# EAGLE design Sport Analyzer Chronojump (EAGLE 9.6.2)
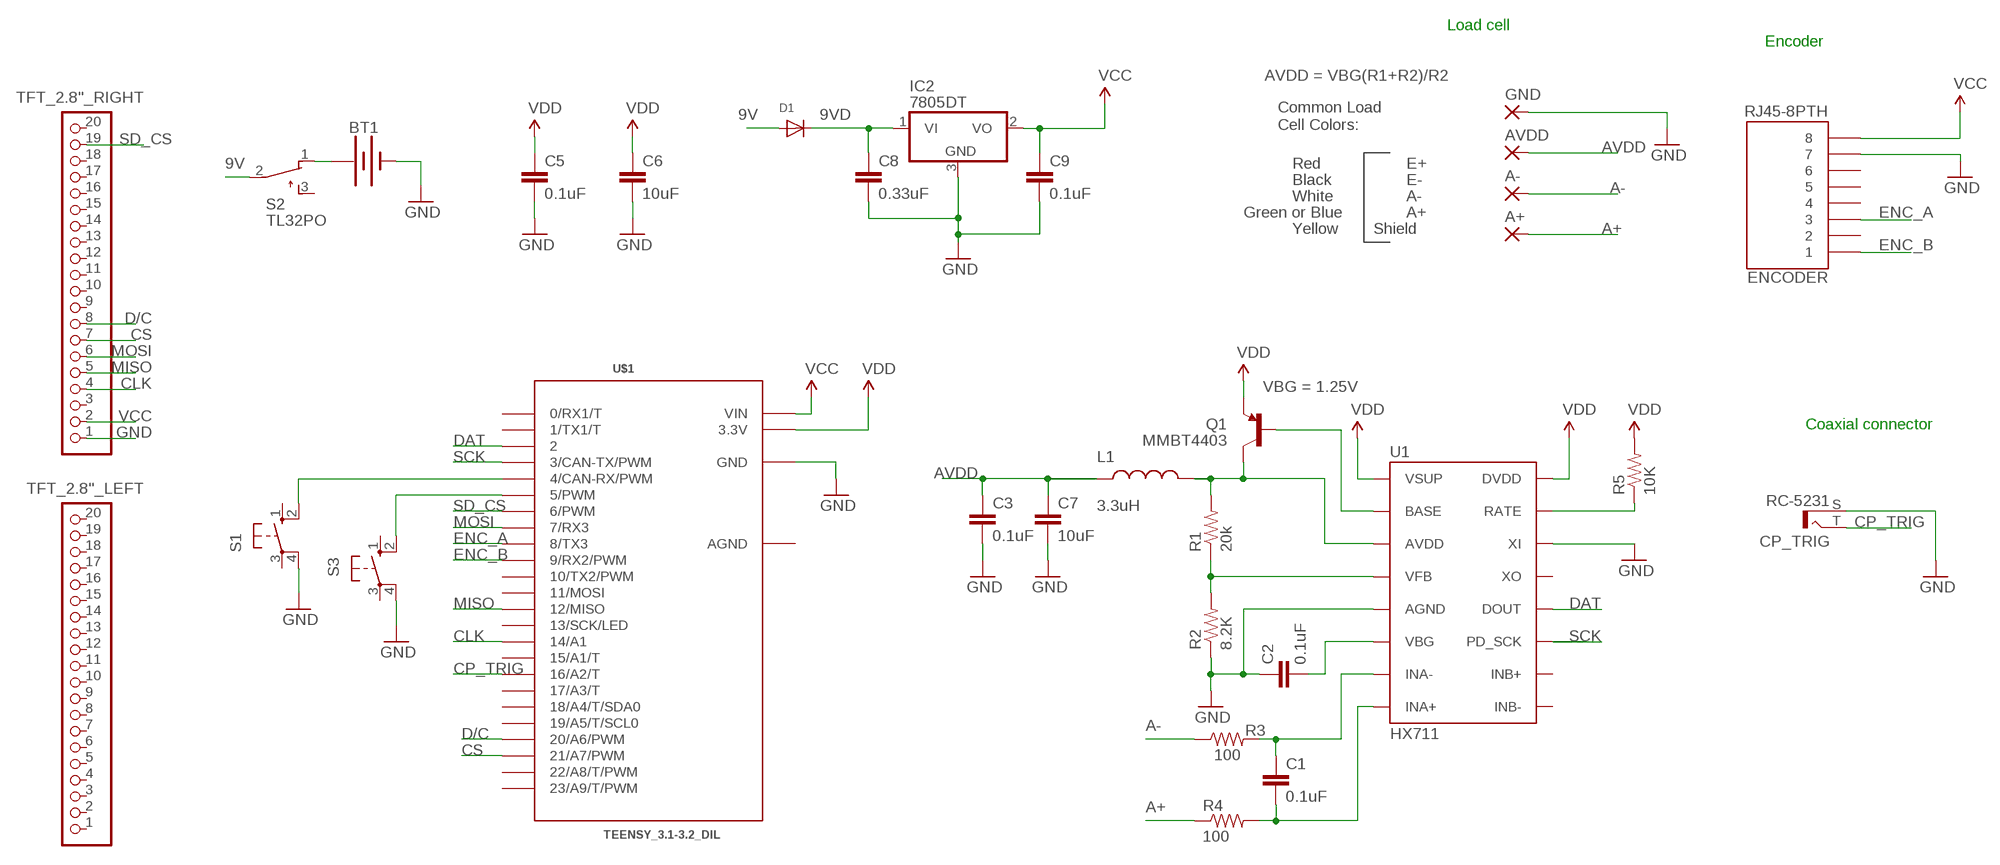
[diagram p0: schematic, sheet 1]

## Parts
A+  3,81/1,4  [3,81/1,4]
A-  3,81/1,4  [3,81/1,4]
AVDD  3,81/1,4  [3,81/1,4]
BT1  BATTERY-9V  [BATTCON_9V]
C1  0.1uF  0.1UF-25V-5%(0603)  [0603-CAP]
C2  0.1uF  0.1UF-25V-5%(0603)  [0603-CAP]
C3  0.1uF  0.1UF-25V-5%(0603)  [0603-CAP]
C5  0.1uF  0.1UF-25V-5%(0603)  [0603-CAP]
C6  10uF  10UF50V20%(1210)  [1210]
C7  10uF  10UF50V20%(1210)  [1210]
C8  0.33uF  0.1UF-25V-5%(0603)  [0603-CAP]
C9  0.1uF  0.1UF-25V-5%(0603)  [0603-CAP]
CP_TRIG  RC-5231  [RC-5231]
D1  DIODESOD-123  [SOD-123]
ENCODER  RJ45-8PTH  [RJ45-8]
GND  3,81/1,4  [3,81/1,4]
IC2  7805DT  [TO252]
L1  3.3uH  INDUCTOR0805-IND  [0805]
Q1  MMBT4403  TRANSISTOR_PNPMMBT4403  [SOT23-3]
R1  20k  20KOHM1/10W1%(0603)  [0603-RES]
R2  8.2K  8.2KOHM-1/10W-5%(0603)  [0603-RES]
R3  100  100OHM-1/10W-1%(0603)  [0603-RES]
R4  100  100OHM-1/10W-1%(0603)  [0603-RES]
R5  10K  10KOHM-1/10W-1%(0603)0603  [0603-RES]
S1  10-XX  [B3F-10XX]
S2  TL32PO  [TL3XPO]
S3  10-XX  [B3F-10XX]
TFT_2.8"_LEFT  PINHD-1X20  [1X20]
TFT_2.8"_RIGHT  PINHD-1X20  [1X20]
U1  HX711  HX711HX711  [SO16]
U$1  TEENSY_3.1-3.2_DIL  [TEENSY_3.0-3.2&LC_DIL]

## Nets
9V: D1.A S2.2(P)
9VD: C8.1 D1.C IC2.1(VI)
A+: A+.1(P) R4.1
A-: A-.1(P) R3.1
AVDD: AVDD.1(P) C3.1 C7.1 L1.1
CLK: TFT_2.8"_RIGHT.4 U$1.14/A0(14/A1)
CP_TRIG: CP_TRIG.T U$1.16/A2(16/A2/T)
CS: TFT_2.8"_RIGHT.7 U$1.21/A7(21/A7/PWM)
D/C: TFT_2.8"_RIGHT.8 U$1.20/A6(20/A6/PWM)
DAT: U1.12(DOUT) U$1.2
ENC_A: ENCODER.3 U$1.8(8/TX3)
ENC_B: ENCODER.1 U$1.9(9/RX2/PWM)
GND: BT1.- C2.1 C3.2 C5.2 C6.2 C7.2 C8.2 C9.2 CP_TRIG.S ENCODER.7 GND.1(P) IC2.3(GND) R2.1 S1.4(P1) S3.4(P1) TFT_2.8"_RIGHT.1 U1.5(AGND) U1.14(XI) U$1.GND
MISO: TFT_2.8"_RIGHT.5 U$1.12(12/MISO)
MOSI: TFT_2.8"_RIGHT.6 U$1.7(7/RX3)
N$1: R5.1 U1.15(RATE)
N$2: C1.1 R3.2 U1.7(INA-)
N$3: C1.2 R4.2 U1.8(INA+)
N$4: Q1.1(B) U1.2(BASE)
N$5: L1.2 Q1.3(C) R1.2 U1.3(AVDD)
N$6: R1.1 R2.2 U1.4(VFB)
N$7: C2.2 U1.6(VBG)
N$8: S1.2(S1) U$1.4(4/CAN-RX/PWM)
N$9: S3.2(S1) U$1.5(5/PWM)
N$42: BT1.+ S2.1(O)
SCK: U1.11(PD_SCK) U$1.3(3/CAN-TX/PWM)
SD_CS: TFT_2.8"_RIGHT.19 U$1.6(6/PWM)
VCC: C9.1 ENCODER.8 IC2.2(VO) TFT_2.8"_RIGHT.2 U$1.VIN
VDD: C5.1 C6.1 Q1.2(E) R5.2 U1.1(VSUP) U1.16(DVDD) U$1.3.3V
Unconnected: ENCODER.2 ENCODER.4 ENCODER.5 ENCODER.6 S1.1(S) S1.3(P) S2.3(S) S3.1(S) S3.3(P) TFT_2.8"_LEFT.1 TFT_2.8"_LEFT.2 TFT_2.8"_LEFT.3 TFT_2.8"_LEFT.4 TFT_2.8"_LEFT.5 TFT_2.8"_LEFT.6 TFT_2.8"_LEFT.7 TFT_2.8"_LEFT.8 TFT_2.8"_LEFT.9 TFT_2.8"_LEFT.10 TFT_2.8"_LEFT.11 TFT_2.8"_LEFT.12 TFT_2.8"_LEFT.13 TFT_2.8"_LEFT.14 TFT_2.8"_LEFT.15 TFT_2.8"_LEFT.16 TFT_2.8"_LEFT.17 TFT_2.8"_LEFT.18 TFT_2.8"_LEFT.19 TFT_2.8"_LEFT.20 TFT_2.8"_RIGHT.3 TFT_2.8"_RIGHT.9 TFT_2.8"_RIGHT.10 TFT_2.8"_RIGHT.11 TFT_2.8"_RIGHT.12 TFT_2.8"_RIGHT.13 TFT_2.8"_RIGHT.14 TFT_2.8"_RIGHT.15 TFT_2.8"_RIGHT.16 TFT_2.8"_RIGHT.17 TFT_2.8"_RIGHT.18 TFT_2.8"_RIGHT.20 U1.9(INB-) U1.10(INB+) U1.13(XO) U$1.0(0/RX1/T) U$1.1(1/TX1/T) U$1.10(10/TX2/PWM) U$1.11(11/MOSI) U$1.13(13/SCK/LED) U$1.15/A1(15/A1/T) U$1.17/A3(17/A3/T) U$1.18/A4(18/A4/T/SDA0) U$1.19/A5(19/A5/T/SCL0) U$1.22/A8(22/A8/T/PWM) U$1.23/A9(23/A9/T/PWM)

## Notes on the sheet
- Load cell
- Encoder
- AVDD = VBG(R1+R2)/R2
- Common Load
  Cell Colors:
- Red | E+
- Black | E-
- White | A-
- Green or Blue | A+
- Yellow | Shield
- VBG = 1.25V
- Coaxial connector

## Power pins joined to a net without a drawn wire
AGND: U$1.AGND

## Library data of the parts
A+ A- AVDD GND = wirepad_xavi:3,81/1,4: THROUGH-HOLE PAD
BT1 = SparkFun-Batteries:BATTERY: Battery - Single Cell A variety of battery chemistries, sizes, and footprints. Device List: 20MM_PTH - Coin Cell Battery Holder - 20mm (PTH) <https://www.sparkfun.com/products/783> 20MM_PTH_KIT- Coin Cell battery Holder - 20 mm (PTH) <http://www.sparkfun.com/products/783>kit version with special mask 6.8MM_PTH - Coin Cell Battery Holder - 6.8MM(SMD) <https://www.digikey.com/product-detail/en/seiko-instruments/MS621FE-FL11E/728-1057-ND/1889208?WT.srch=1&gclid=CNOQ5a6LzdQCFZS2wAodXCkE0g> 12MM_SMD - Coin Cell Battery Holder - 12mm (SMD) <https://www.sparkfun.com/products/10592> 12MM_PTH - Coin Cell Battery Holder - 12mm (PTH) <https://www.sparkfun.com/products/7948> 20MM_SMD - 20mm Coin Cell Battery Holder (SMD) (2 legs) Used on the Big Time Watch Kit <https://www.sparkfun.com/products/11734> 20MM_SMD_4LEGS - Coin Cell Battery Holder - 20mm (SMD) <https://www.sparkfun.com/products/11892> 20MM_SMD_4LEGS_OVERPASTE - Coin Cell Battery Holder - 20mm (SMD) <https://www.sparkfun.com/products/11892> (Over-paste on the legs) 24.5MM_PTH - Coin Cell Battery Holder - 24.5mm (PTH) <https://www.sparkfun.com/products/8863> 9V - 9V Battery Holder - PC Mount Used on the SparkFun SparkPunk Sound Kit <https://www.sparkfun.com/products/11177> and SparkFun SparkPunk Sequencer Kit <https://www.sparkfun.com/products/12707> 18650 - Battery Holder - 18650 (PTH) <https://www.sparkfun.com/products/13113> AA - Battery Holder - 1xAA (PTH) <https://www.sparkfun.com/products/7949> AAA - Battery Holder - 1xAAA (PTH) <https://www.sparkfun.com/products/12718> AA_KIT - Battery Holder - 1xAA (PTH) <https://www.sparkfun.com/products/7949> Special kit package - pads only have exposed copper on one side of the board. AAA_KIT - Battery Holder - 1xAAA (PTH) <https://www.sparkfun.com/products/12718> Special kit package - pads only have exposed copper on one side of the board.; PROD_ID: BATT-10855
C1-C3 C5 C9 = SparkFun-Capacitors:0.1UF-25V-5%(0603): CAP-08604; PROD_ID: CAP-08604
C6 C7 = SparkFun-Capacitors:10UF50V20%(1210): CAP-09824; PROD_ID: CAP-09824
C8 = SparkFun-Capacitors:0.1UF-25V-5%(0603): CAP-08604; PROD_ID: CAP-08604; VALUE: 0.1uF
CP_TRIG = con-lumberg:RC-5231: RCA connectors according to JEITA RC-5231 RCA-Steckverbinder nach JEITA RC-5231 Source: RCA- Stecker 2poolig.pdf
D1 = adafruit:DIODE: Diode SMADIODE - SMA Surface Mount Package 20V 1A Schottky Diode Digikey: 641-1014-6-ND DO-1N4148 - Through Hole Small Current Diode SOD-123 20V 1 A (.5mV Vf) Schottky Diode - Digikey: MBRX120TPMSCT-ND SOD-323 10V 570mA (.38mV Vf, 3ns) Schottky Diode - Digikey: ZLLS410CT-ND SOD-523 30V 30mA Schottky Diode (RB751S-40TE61) - Digikey: RB751S-40TE61CT-ND SOT23-R/W - SOT23 Package (R = Solder Paste/Reflow Ovens, W = Hand-Soldering) BAT54Film 40V 300mA - Digikey: 497-7162-1-ND
ENCODER = SparkFun:RJ45-8: RJ45 Jack Simple RJ45, 8-pin connection - connector for common Cat5, Cat5e, and Cat6 Ethernet cables. Footprint not yet proven in production. Connector sku is PRT-00643; Breakout PCB sku is BOB-00716.
IC2 = linear:78*: Positive VOLTAGE REGULATOR Source: http://cache.national.com/ds/LM/LM78L05.pdf http://www.fairchildsemi.com/ds/LM/LM7805.pdf
L1 = SparkFun-Passives:INDUCTOR: Inductors Basic Inductor/Choke - 0603 and 1206. Footprints are not proven and vary greatly between part numbers. INDUCTOR POWER 3.3UH 4.0A SMD 0.197" L x 0.197" W x 0.177" H (5.00mm x 5.00mm x 4.50mm); PROD_ID: NDUC-13076
Q1 = SparkFun-DiscreteSemi:TRANSISTOR_PNP: Generic PNP BJT Double check pinouts against datasheets- not all devices are the same! MMBT3906 - 40V 200mA SOT-23 (TRANS-08052) MMBT4403 - 40V 600mA SOT-23 (TRANS-09245); PROD_ID: TRANS-09245
R1 = SparkFun-Resistors:20KOHM1/10W1%(0603): RES-09383; PROD_ID: RES-09383
R2 = SparkFun-Resistors:8.2KOHM-1/10W-5%(0603): RES-10646; PROD_ID: RES-10646
R3 R4 = SparkFun-Resistors:100OHM-1/10W-1%(0603): RES-07863; PROD_ID: RES-07863
R5 = SparkFun-Resistors:10KOHM-1/10W-1%(0603): RES-00824; PROD_ID: RES-00824
S1 S3 = switch-omron:10-XX: OMRON SWITCH; MPN: B3F-1000; OC_FARNELL: 176432; OC_NEWARK: 36M3542
S2 = switch:TL32PO: TINY SWITCH ON - MOM Source: http://www2.produktinfo.conrad.com/datenblaetter/700000-724999/705152-da-01-de-Subminiaturschalter_TL_36YO.pdf
TFT_2.8"_LEFT TFT_2.8"_RIGHT = pinhead:PINHD-1X20: PIN HEADER
U1 = Testing:HX711; PROD_ID: IC-12445
U$1 = Teensy_3_and_LC_Series_Boards_v1.4:TEENSY_3.1-3.2_DIL: Teensy 3.1 or 3.2 in a DIL Layout.

## Board
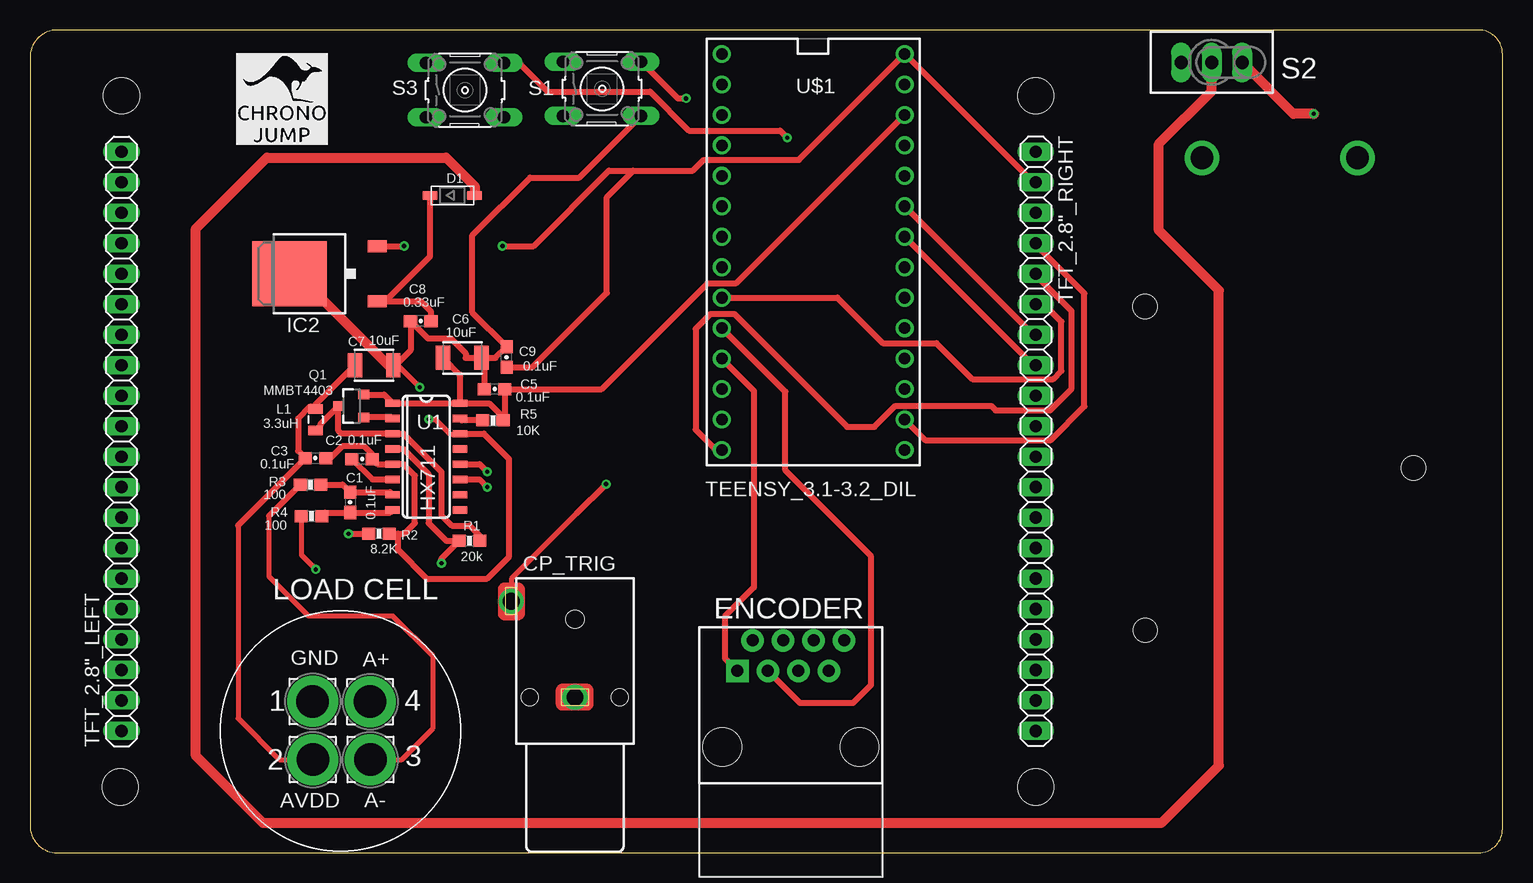
[diagram p1: board, top side]
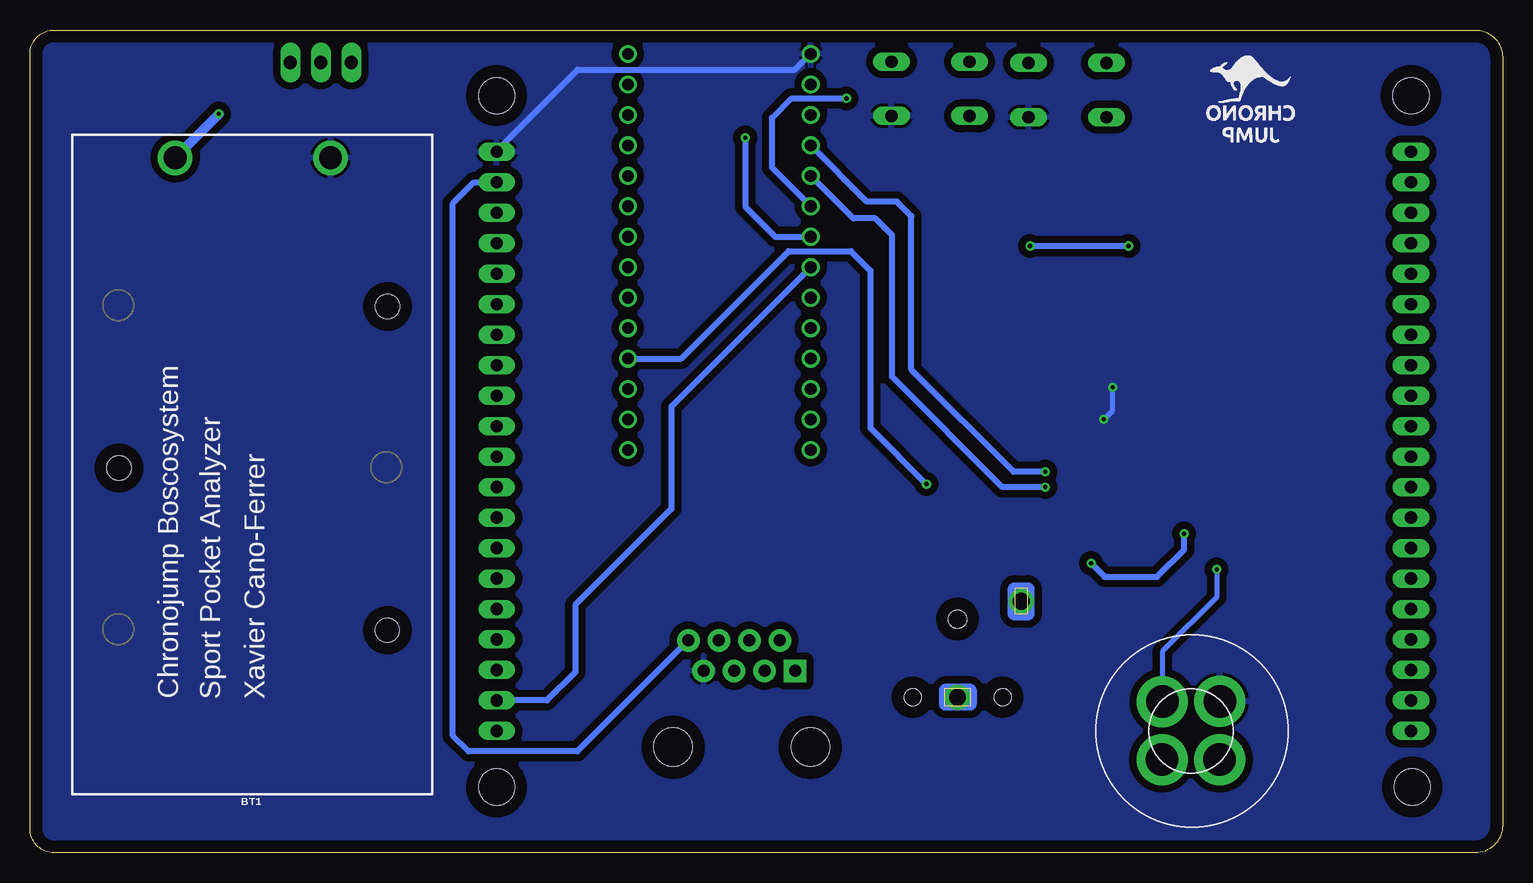
[diagram p2: board, bottom side, seen from below]

Size 122.71 x 68.57 mm. Coordinates in mm from the lower left corner, seen from the top.
Outline: 0,66.3 0,2.27 arc90 2.27,0 120.71,0 arc90 122.71,2 122.71,66.57 arc90 120.71,68.57 2.27,68.57 arc90 0,66.3
Copper layers (1*16): Top 0.035mm / dielectric 1.5mm / Bottom 0.035mm
Design rules "default": minimum track width 6mil, minimum drill 0.35mm, track to track 6mil, track to pad 6mil, pad to pad 6mil, via to via 6mil, smd to smd 6mil, copper to edge 40mil, drill to drill 6mil, minimum pad ring 10mil, minimum via ring 8mil, stop-mask expansion 4mil, vias tented up to drill 0mil, thermal gap 10mil
Holes 3 mm at 7.62,63.1 83.82,5.48 83.82,63.1 7.52,5.48
Holes 2 mm at 92.92,45.53 115.29,32.07 92.93,18.55

### Footprints (pad centres in the part's own frame; a part is rotated, then mirrored left to right if it is on the bottom)
3,81/1,4 = drill 2.7 pad 4.25: 1 0,0
BATTCON_9V = drill 1.905: + 0,0; - 0,-12.954
0603-CAP = smd 1.1 x 1: 1 -0.85,0; 2 0.85,0
1210 = smd 1.2 x 2: 1 -1.6,0; 2 1.6,0
RC-5231 = drill 1.4 pad 1.778: S 0,0; T 5.3,-8 | hole 1.4: -3.75,0; 3.75,0 | hole 1.5: 0,-6.5
SOD-123 = smd 1.2 x 0.7: A 1.85,0; C -1.85,0
RJ45-8 = drill 1 pad 1.88 square: 1 -4.445,6.35 | drill 1 pad 1.88: 2 -3.175,8.89; 3 -1.905,6.35; 4 -0.635,8.89; 5 0.635,6.35; 6 1.905,8.89; 7 3.175,6.35; 8 4.445,8.89 | hole 3.2: -5.715,0; 5.715,0
TO252 = smd 1 x 1.6: 1 -2.28,-4.8; 2 2.28,-4.8 | smd 5.4 x 6.2: 3 0,2.5
0805 = smd 0.8 x 1.2: 1 -0.9,0; 2 0.9,0
SOT23-3 = smd 0.8 x 0.9: 1 -0.95,-1; 2 0.95,-1; 3 0,1.1
0603-RES = smd 1.1 x 1: 1 -0.85,0; 2 0.85,0
B3F-10XX = drill 1.016 long: 1 -3.251,2.261; 2 3.251,2.261; 3 -3.251,-2.261; 4 3.251,-2.261
TL3XPO = drill 1.1 pad 1.422 long: 1 -2.54,0; 2 0,0; 3 2.54,0
1X20 = drill 1.016 long: 1 -24.13,0; 2 -21.59,0; 3 -19.05,0; 4 -16.51,0; 5 -13.97,0; 6 -11.43,0; 7 -8.89,0; 8 -6.35,0; 9 -3.81,0; 10 -1.27,0; 11 1.27,0; 12 3.81,0; 13 6.35,0; 14 8.89,0; 15 11.43,0; 16 13.97,0; 17 16.51,0; 18 19.05,0; 19 21.59,0; 20 24.13,0
SO16 = smd 0.6 x 1.2: 1 -4.445,-2.8; 2 -3.175,-2.8; 3 -1.905,-2.8; 4 -0.635,-2.8; 5 0.635,-2.8; 6 1.905,-2.8; 7 3.175,-2.8; 8 4.445,-2.8; 9 4.445,2.8; 10 3.175,2.8; 11 1.905,2.8; 12 0.635,2.8; 13 -0.635,2.8; 14 -1.905,2.8; 15 -3.175,2.8; 16 -4.445,2.8
TEENSY_3.0-3.2&LC_DIL = drill 0.965: 0 -7.62,13.97; 1 -7.62,11.43; 2 -7.62,8.89; 3 -7.62,6.35; 3.3V 7.62,11.43; 4 -7.62,3.81; 5 -7.62,1.27; 6 -7.62,-1.27; 7 -7.62,-3.81; 8 -7.62,-6.35; 9 -7.62,-8.89; 10 -7.62,-11.43; 11 -7.62,-13.97; 12 -7.62,-16.51; 13 7.62,-16.51; 14/A0 7.62,-13.97; 15/A1 7.62,-11.43; 16/A2 7.62,-8.89; 17/A3 7.62,-6.35; 18/A4 7.62,-3.81; 19/A5 7.62,-1.27; 20/A6 7.62,1.27; 21/A7 7.62,3.81; 22/A8 7.62,6.35; 23/A9 7.62,8.89; AGND 7.62,13.97; GND -7.62,16.51; VIN 7.62,16.51

### Placement (x,y rotation side)
A+  28.34,12.6 0 top
A-  28.37,7.77 0 top
AVDD  23.57,7.77 0 top
BT1  110.62,57.91 90 bottom
C1  26.67,29.21 270 top
C2  27.67,32.82 180 top
C3  23.79,32.89 0 top
C5  38.71,38.64 180 top
C6  36.03,41.24 0 top
C7  28.67,40.64 0 top
C8  32.56,44.32 180 top
C9  39.71,41.32 90 top
CP_TRIG  45.41,12.98 180 top
D1  35.2,54.78 0 top
ENCODER  63.4,8.81 0 top
GND  23.54,12.62 0 top
IC2  24.13,48.26 90 top
L1  23.79,36.1 270 top
Q1  26.8,37.23 90 top
R1  36.63,26 0 top
R2  29.08,26.6 180 top
R3  23.39,30.68 0 top
R4  23.46,28.07 0 top
R5  38.57,36.03 0 top
S1  47.67,63.67 0 top
S2  98.47,65.87 180 top
S3  36.25,63.56 0 top
TFT_2.8"_LEFT  7.62,34.29 90 top
TFT_2.8"_RIGHT  83.82,34.29 270 top
U1  33.02,33.02 270 top
U$1  65.27,50.07 0 top

### Tracks (layer width: path | path; a pad name or v marks a point on that pad's centre or on a via)
9V
  Top 0.813: S2.2 98.47,63.48 94.07,59.08 94.07,51.87 99.07,46.87 99.07,7.27 94.27,2.47 19.42,2.47 13.82,8.08 13.82,52.02 19.73,57.93 34.67,57.93 37.05,55.56 D1.A
9VD
  Top 0.508: C8.1 33.41,45.12 32.55,45.98 IC2.1 29.6,45.98 33.35,49.73 D1.C
A+  (via drill 0.35)
  Top 0.406: R4.1 22.61,24.83 v23.82,23.62
  Bottom 0.406: v23.82,23.62 23.82,21.31 28.34,16.79 A+.1
A-
  Top 0.406: A-.1 30.99,7.77 33.6,10.39 33.6,16.38 30.25,19.73 23.21,19.73 19.94,23.01 19.94,28.08
  Top 0.508: 19.94,28.08 R3.1
AVDD
  Top 0.406: 17.35,27.3 17.35,11.2 20.78,7.77 AVDD.1
  Top 0.508: C7.1 23.79,37.36 L1.1 23.62,37.17 23.32,37.17 22.34,36.19 22.34,33.49 C3.1 17.35,27.3
CLK
  Top 0.508: TFT_2.8"_RIGHT.4 83.82,50.67 87.87,46.62 87.87,37.2 85.07,34.39 74.6,34.39 U$1.14/A0
CP_TRIG  (via drill 0.35)
  Top 0.406: 45.54,28.27 40.11,22.84 CP_TRIG.T
  Top 0.508: v48,30.73 45.54,28.27
  Bottom 0.508: U$1.16/A2 68.44,41.18 59.48,50.14 54.3,50.14 52.68,48.51 52.68,35.41 v48,30.73
CS
  Top 0.508: U$1.21/A7 83.59,43.18 TFT_2.8"_RIGHT.7
D/C
  Top 0.508: U$1.20/A6 83.59,40.64 TFT_2.8"_RIGHT.8
DAT  (via drill 0.35)
  Top 0.508: U1.12 37.47,32.39 v38.1,31.75
  Bottom 0.508: v38.1,31.75 40.75,31.75 49.27,40.27 49.27,53.07 50.47,54.27 52.96,54.27 U$1.2
ENC_A
  Top 0.508: ENCODER.3 64.16,12.49 68.6,12.49 70.1,13.99 70.1,24.71 62.94,31.87 62.94,38.43 U$1.8
ENC_B
  Top 0.508: U$1.9 60.33,38.51 60.33,22.12 57.91,19.71 57.91,16.2 ENCODER.1
GND  (via drill 0.35)
  Top 0.406: C7.2 30.65,40.64 v32.48,38.81 | v33.22,36.14 33.78,36.14 35.03,34.89 35.78,34.89
  Top 0.508: C2.1 28.95,32.39 U1.5 31.12,32.39 32.07,31.43 32.07,27.47 31.2,26.6 30.67,26.6 | C2.1 28.32,33.02 | 35.78,34.89 U1.14 37.82,34.93 39.93,32.82 39.93,24.69 38.1,22.86 33.07,22.86 30.67,25.26 30.67,26.6 | C7.2 30.47,40.64 31.71,41.88 C8.2 33.16,42.87 35.07,42.87 36.3,41.64 36.3,41.24 C6.2 | C2.1 28.52,33.22 27.87,33.87 26.02,33.87 25.04,32.89 C3.2 | C6.2 37.86,41.01 C5.2 | C6.2 38.78,41.24 C9.2 36.87,45.01 36.87,51.47 41.67,56.27 45.78,56.27 S1.4 | R2.1 30.67,26.6
  Top 0.813: IC2.3 22.23,48.26 29.85,40.64 C7.2
  Bottom 0.406: v32.48,38.81 32.53,38.76 32.53,36.8 33.2,36.14 v33.22,36.14
  Bottom 0.508: U$1.GND 58.96,65.27 77.07,65.27 83.82,58.52 TFT_2.8"_RIGHT.1
  pour Bottom (isolate 0.61): 120.84,68.58 2,68.58 arc90 0,66.58 0,2 arc90 2,0 121.57,0 123.04,1.47 123.04,66.38 arc90
MISO
  Top 0.508: TFT_2.8"_RIGHT.5 83.82,48.13 86.81,45.14 86.81,38.68 85,36.87 80.47,36.87 80.1,37.24 72.11,37.24 70.36,35.5 68.09,35.5 58.67,44.92 56.72,44.92 55.47,43.67 55.47,35.27 57.18,33.56 U$1.12
MOSI
  Top 0.508: TFT_2.8"_RIGHT.6 84.49,45.72 85.95,44.26 85.95,40.16 85.27,39.47 78.53,39.47 75.54,42.47 71.07,42.47 67.28,46.26 U$1.7
N$1
  Top 0.508: R5.1 35.98,36.03 U1.15
N$2
  Top 0.508: R3.2 26.05,30.68 C1.1 30.01,30.06 U1.7
N$3
  Top 0.508: U1.8 30.01,28.36 C1.2 24.6,28.36 R4.2
N$4
  Top 0.508: U1.2 30.14,36.28 Q1.1
N$5
  Top 0.508: R1.2 37.48,26.42 36.63,27.27 35.16,27.27 34.29,28.14 34.29,31.75 31.12,34.93 U1.3 25.93,34.93 25.7,35.16 Q1.3 24.22,35.75 24.22,35.63 L1.2
N$6  (via drill 0.35)
  Top 0.508: U1.4 31.12,33.66 33.22,31.55 33.22,27.47 34.69,26 R1.1 34.29,24.51 v34.29,24.13 | v26.54,26.6 R2.2
  Bottom 0.508: v34.29,24.13 33.15,22.99 28.81,22.99 26.54,25.26 v26.54,26.6
N$7
  Top 0.508: C2.2 28.53,31.12 U1.6
N$8  (via drill 0.35)
  Top 0.508: S1.2 53.98,62.87 v54.67,62.87
  Bottom 0.508: U$1.4 60.87,57.1 60.87,61.27 59.27,62.87 v54.67,62.87
N$9  (via drill 0.35)
  Top 0.508: S3.2 40.75,65.82 43.14,63.43 51.67,63.43 54.91,60.19 62.5,60.19 v63.1,59.59
  Bottom 0.508: v63.1,59.59 63.1,53.85 60.59,51.34 U$1.5
N$42  (via drill 0.35)
  Top 0.813: v106.98,61.59 105.29,61.59 S2.1
  Bottom 0.813: BT1.+ 106.98,61.55 v106.98,61.59
SCK  (via drill 0.35)
  Top 0.508: U1.11 37.47,31.12 v38.1,30.48
  Bottom 0.508: v38.1,30.48 41.68,30.48 50.87,39.67 50.87,51.47 52.27,52.87 54.1,52.87 U$1.3
SD_CS
  Bottom 0.508: U$1.6 69.27,37.18 69.27,28.67 77.27,20.67 77.27,15.07 79.64,12.7 TFT_2.8"_RIGHT.19
VCC  (via drill 0.35)
  Top 0.508: 50.27,56.84 48.24,56.84 41.97,50.57 v39.37,50.57 | 50.27,56.84 48.07,54.64 48.07,46.67 41.87,40.47 C9.1 | 50.27,56.84 55.24,56.84 56.16,57.76 64.07,57.76 U$1.VIN 83.59,55.88 TFT_2.8"_RIGHT.2 | v31.17,50.57 31.07,50.47 31,50.54 IC2.2
  Bottom 0.508: v31.17,50.57 39.17,50.57 39.27,50.47 v39.37,50.57 | ENCODER.8 77.09,8.46 86.16,8.46 87.48,9.78 87.48,54.12 85.72,55.88 TFT_2.8"_RIGHT.2
VDD
  Top 0.508: Q1.2 29.51,38.18 U1.1 U1.16 | C6.1 35.82,39.85 35.82,38.48 U1.16 | U$1.3.3V 58.86,47.47 56.47,47.47 47.64,38.64 C5.1 39.56,36.17 | 39.56,36.17 R5.2 | U1.16 38.27,37.47 39.56,36.17

### Text on the board
tNames: LOAD CELL | ENCODER | 1 | 4 | 3 | 2
bNames: Xavier Cano-Ferrer | Sport Pocket Analyzer | Chronojump Boscosystem